# Altium schematic sheet CanCom_Sch.SchDoc
size A4; SheetNumber: 1; SheetTotal: 1
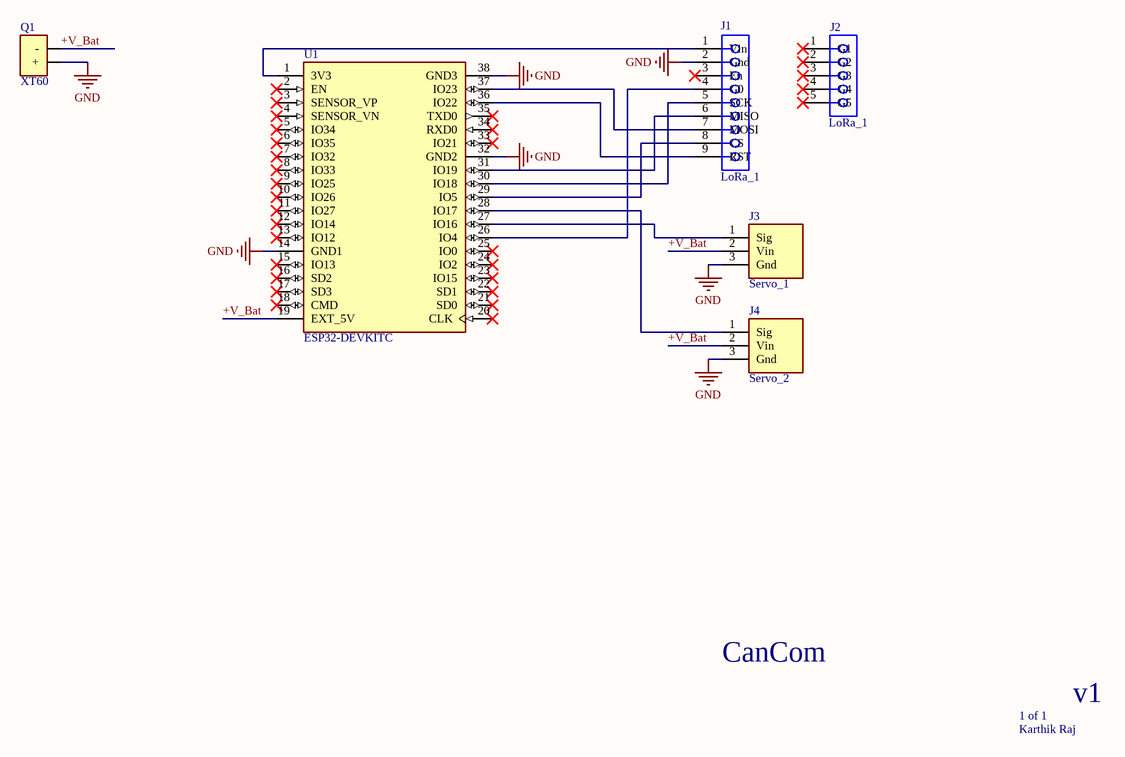
[diagram p0: CanCom_Sch.SchDoc]

## Parts
J1  LoRa_1  [61300911821]
J2  LoRa_1  [61300511821]
J3  Servo_1  [TE_87220-3]
J4  Servo_2  [TE_87220-3]
Q1  XT60  [AMASS_XT60PB-M]
U1  ESP32-DEVKITC  [MODULE_ESP32-DEVKITC]

## Nets
GND: J1.2(Gnd) J3.3(Gnd) J4.3(Gnd) Q1.1(+) U1.14(GND1) U1.32(GND2) U1.38(GND3)
+V_Bat: J3.2(Vin) J4.2(Vin) Q1.2(-) U1.19(EXT_5V)
NetJ1_1: J1.1(Vin) U1.1(3V3)
NetJ1_4: J1.4(G0) U1.26(IO4)
NetJ1_5: J1.5(SCK) U1.30(IO18)
NetJ1_6: J1.6(MISO) U1.31(IO19)
NetJ1_7: J1.7(MOSI) U1.37(IO23)
NetJ1_8: J1.8(CS) U1.29(IO5)
NetJ1_9: J1.9(RST) U1.36(IO22)
NetJ3_1: J3.1(Sig) U1.27(IO16)
NetJ4_1: J4.1(Sig) U1.28(IO17)

Not connected (* = marked no-connect by the designer): J1 3(En)*; J2 1(G1)* 2(G2)* 3(G3)* 4(G4)* 5(G5)*; U1 2(EN)* 3(SENSOR_VP)* 4(SENSOR_VN)* 5(IO34)* 6(IO35)* 7(IO32)* 8(IO33)* 9(IO25)* 10(IO26)* 11(IO27)* 12(IO14)* 13(IO12)* 15(IO13)* 16(SD2)* 17(SD3)* 18(CMD)* 20(CLK)* 21(SD0)* 22(SD1)* 23(IO15)* 24(IO2)* 25(IO0)* 33(IO21)* 34(RXD0)* 35(TXD0)*

## Notes on the sheet
- CanCom
- 1 of 1
- v1
- Karthik Raj

## Library data of the parts
J1 = CMP-1502-01331-2: NexarPartId: 61924727; Operating Supply Voltage: 250V; Current Rating: 3A; Gender: Female; Contact Resistance: 20mΩ; RoHS: Non-Compliant; Number of Pins: 9; Orientation: Vertical; Lead Pitch: 2.54mm
J2 = CMP-1502-01320-2: NexarPartId: 61924716; Gender: Female; Operating Supply Voltage: 250V; Contact Resistance: 20mΩ; Current Rating: 3A; Number of Pins: 5; Lead Pitch: 2.54mm; RoHS: Non-Compliant; Orientation: Vertical
J3 J4 = CMP-002-00071-1: Header; Standard; PC Board; Single; 3; 0.025 in.; 0.125 in.; Square; 0.1 in.; Number_of_Positions: 3; Centerline_Pitch: 2.54 mm[.1 in]; Product_Type: Connector; MF: TE Connectivity; Pins: 3; MP: 87220-3; SnapEDA_Link: https://www.snapeda.com/parts/87220-3/TE%20Connectivity%20AMP%20Connectors/view-part/499136/?ref=snap; Component Type: Standard; Source: SnapEDAsch.SchLib; Case/Package: None; Digi-Key_Purchase_URL: https://www.digikey.com/product-detail/en/te-connectivity-amp-connectors/87220-3/A26544-ND/298245?utm_source=snapeda&utm_medium=aggregator&utm_campaign=symbol; EU_RoHS_Compliance: Compliant; Design Item ID: 87220-3; TE_purchase_URL: https://www.te.com/usa-en/product-87220-3.html?te_bu=Cor&te_type=disp&te_campaign=seda_glo_cor-seda-global-disp-prtnr-fy19-seda-model-bom-cta_sma-317_1&elqCampaignId=32493; Value: *; Digi-Key_Part_Number: A26544-ND
Q1 = CMP-019-000000-1: Power connector; 65A; PIN: 2; Colour: yellow; MP: XT60 YELLOW; MF: Pololu; Component Type: Standard; SnapEDA_Link: https://www.snapeda.com/parts/XT60%20YELLOW/Pololu/view-part/?ref=snap; Availability: Not in stock; Check_prices: https://www.snapeda.com/parts/XT60%20YELLOW/Pololu/view-part/?ref=eda; Value: *; Design Item ID: XT60_YELLOW; Source: XT60_YELLOW.SchLib; Price: None; Package: None; Pin Count: 2
U1 = CMP-017-000000-1: ESP32-WROOM-32UE series Transceiver; 802.11 b/g/n (Wi-Fi, WiFi, WLAN), Bluetooth Â® Smart Ready 4.x Dual Mode Evaluation Board; MF: Espressif Systems; Source: ESP32-DEVKITC.SchLib; Pin Count: 38; Component Type: Standard; Value: *; Package: None; MP: ESP32-DEVKITC; Check_prices: https://www.snapeda.com/parts/ESP32-DEVKITC/Espressif+Systems/view-part/?ref=eda; Purchase-URL: https://pricing.snapeda.com/search/part/ESP32-DEVKITC/?ref=eda; Price: None; Design Item ID: ESP32-DEVKITC; SnapEDA_Link: https://www.snapeda.com/parts/ESP32-DEVKITC/Espressif+Systems/view-part/?ref=snap; Availability: In Stock